# EAGLE design BATT_CONNECTOR (EAGLE 9.6.2)
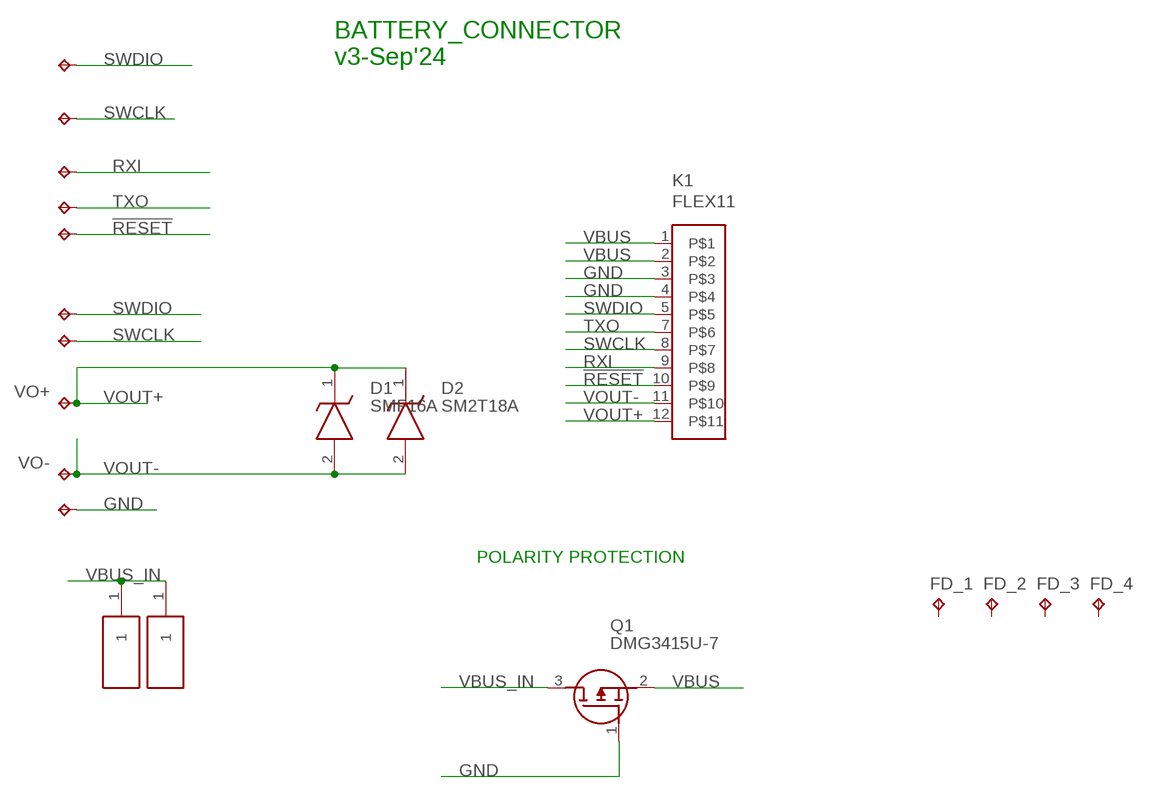
[diagram p0: schematic, sheet 1]

## Parts
!RESET  TPB2,54  [B2,54]
D1  SMF16A  [SODFL3618X110N]
D2  SM2T18A  [SM2T18A]
DAT  TPB2,54  [B2,54]
FD_1  FD_1  TPTP06SQ  [TP06SQ]
FD_2  FD_1  TPTP06SQ  [TP06SQ]
FD_3  FD_1  TPTP06SQ  [TP06SQ]
FD_4  FD_1  TPTP06SQ  [TP06SQ]
GND  TPB2,54  [B2,54]
H1  S1761-42R  [S176142R]
H2  S1761-42R  [S176142R]
ID  TPB2,54  [B2,54]
K1  FLEX11  [FLEX11]
Q1  DMG3415U-7  SSM3J338R,LF  [SSM3J332RLFT]
RXI  TPB2,54  [B2,54]
SWCLK  TPB2,54  [B2,54]
SWDIO  TPB2,54  [B2,54]
TXO  TPB2,54  [B2,54]
VO+  TPB2,54  [B2,54]
VO-  TPB2,54  [B2,54]

## Nets
!RESET: !RESET.TP K1.10
GND: GND.TP K1.3 K1.4 Q1.1(G)
RXI: K1.9 RXI.TP
SWCLK: ID.TP K1.8 SWCLK.TP
SWDIO: DAT.TP K1.5 SWDIO.TP
TXO: K1.7 TXO.TP
VBUS: K1.1 K1.2 Q1.2(S)
VBUS_IN: H1.1 H2.1 Q1.3(D)
VOUT+: D1.1(K) D2.1(K) K1.12 VO+.TP
VOUT-: D1.2(A) D2.2(A) K1.11 VO-.TP
Unconnected: FD_1.TP FD_2.TP FD_3.TP FD_4.TP

## Notes on the sheet
- BATTERY_CONNECTOR
  v3-Sep'24
- POLARITY PROTECTION

## Library data of the parts
!RESET DAT FD_1-FD_4 GND ID RXI SWCLK SWDIO TXO VO+ VO- = testpad:TP: Test pad
D1 = SMF16A:SMF16A: ESD Suppressors / TVS Diodes 200W 16V 5% Uni-directional Source: Datasheet <https://www.littelfuse.com/~/media/electronics/datasheets/tvs_diodes/littelfuse_tvs_diode_smf_datasheet.pdf.pdf>; ARROW_PART_NUMBER: SMF16A; ARROW_PRICE-STOCK: https://www.arrow.com/en/products/smf16a/littelfuse; DESCRIPTION: ESD Suppressors / TVS Diodes 200W 16V 5% Uni-directional; HEIGHT: 1.1mm; MANUFACTURER_NAME: LITTELFUSE; MANUFACTURER_PART_NUMBER: SMF16A; MOUSER_PART_NUMBER: 576-SMF16A; MOUSER_PRICE-STOCK: https://www.mouser.co.uk/ProductDetail/Littelfuse/SMF16A?qs=IP%252BaFeBnnar8T%2Ffm%252BJ%2Flrw%3D%3D
D2 = SM2T18A:SM2T18A: 200 W TVS in STmite Source: Datasheet <https://www.st.com/resource/en/datasheet/sm2t.pdf>; DESCRIPTION: 200 W TVS in STmite; HEIGHT: 1.15mm; MANUFACTURER_NAME: STMicroelectronics; MANUFACTURER_PART_NUMBER: SM2T18A; MOUSER_PART_NUMBER: 511-SM2T18A; MOUSER_PRICE-STOCK: https://www.mouser.co.uk/ProductDetail/STMicroelectronics/SM2T18A?qs=9NrABl3fj%2FoQ9e7jVf8sKA%3D%3D
H1 H2 = S1761-42R:S1761-42R: EZ_Boardware SMT Spring Contact 3.5mm Source: Datasheet <https://cdn.harwin.com/pdfs/S1761-XXR.pdf>; DESCRIPTION: EZ_Boardware SMT Spring Contact 3.5mm; HEIGHT: 3.8mm; MANUFACTURER_NAME: Harwin; MANUFACTURER_PART_NUMBER: S1761-42R; MOUSER_PART_NUMBER: 855-S1761-42R; MOUSER_PRICE-STOCK: https://www.mouser.co.uk/ProductDetail/Harwin/S1761-42R?qs=ulE8k0yEMYZkmoaxRCFkSQ%3D%3D
K1 = Flex_3mm:FLEX11
Q1 = SSM3J338R_LF:SSM3J338R,LF: MOSFET Small-signal MOSFET Vdss= -12V, ID= -6A Source: Datasheet <http://toshiba.semicon-storage.com/info/docget.jsp?did=30384&prodName=SSM3J338R>; ARROW_PART_NUMBER: SSM3J338R,LF; ARROW_PRICE-STOCK: https://www.arrow.com/en/products/ssm3j338rlf/toshiba?region=nac; DESCRIPTION: MOSFET Small-signal MOSFET Vdss= -12V, ID= -6A; HEIGHT: mm; MANUFACTURER_NAME: Toshiba; MANUFACTURER_PART_NUMBER: SSM3J338R,LF; MOUSER_PART_NUMBER: 757-SSM3J338RLF; MOUSER_PRICE-STOCK: https://www.mouser.co.uk/ProductDetail/Toshiba/SSM3J338RLF?qs=lhkzy8lC%252BSvURFM9ZjmJSw%3D%3D

## Board
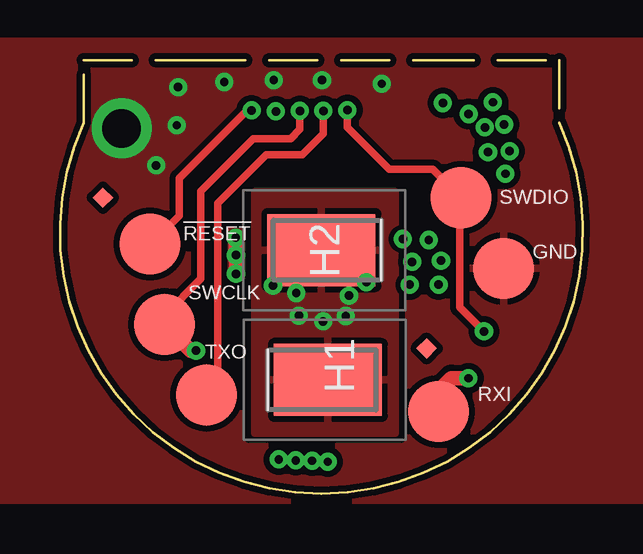
[diagram p1: board, top side]
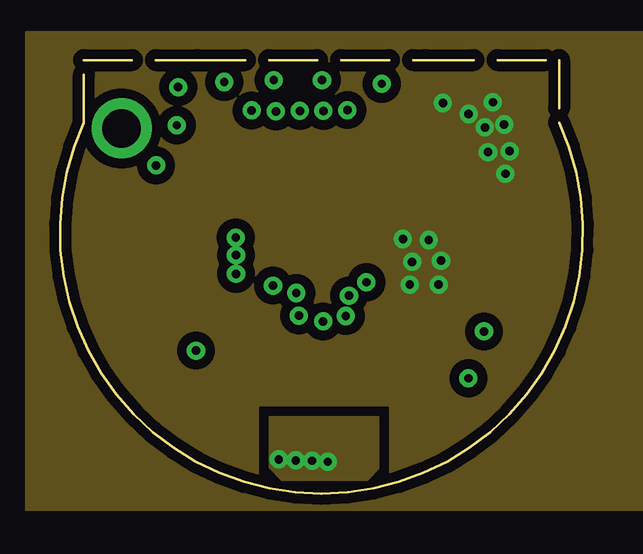
[diagram p2: board, inner layer Route2]
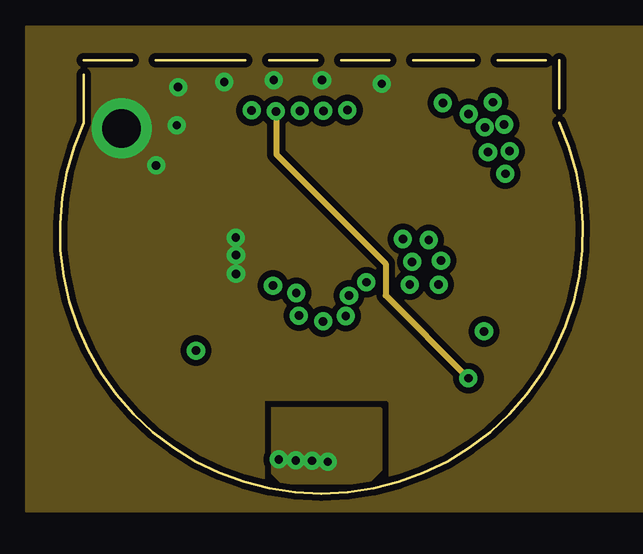
[diagram p3: board, inner layer Route15]
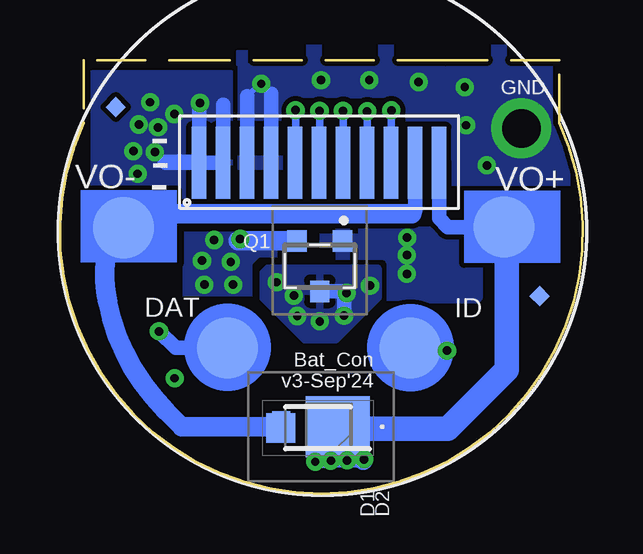
[diagram p4: board, bottom side, seen from below]

Size 21.79 x 18.07 mm. Coordinates in mm from the lower left corner, seen from the top.
Outline: 20.79,18.07 20.79,15.46 arc-229 0.99,15.46 0.99,18.07 5.73,18.07 5.71,18.06 15.21,18.06 15.23,18.07 20.79,18.07
Copper layers (1+2*15+16): Top 0.035mm / dielectric 1.5mm / Route2 0.035mm / dielectric 0.15mm / Route15 0.035mm / dielectric 0.2mm / Bottom 0.035mm
Design rules "default *": minimum track width 0.00038125mm, minimum drill 0.35mm, track to track 8mil, track to pad 8mil, pad to pad 8mil, via to via 8mil, smd to smd 5mil, copper to edge 8mil, drill to drill 8mil, minimum pad ring 10mil, minimum via ring 8mil, stop-mask expansion 2mil, vias tented up to drill 50mil, thermal gap 10mil
tRestrict: area 7.3,11.4 to 7.7,12.5; area 7.1,5.2 to 7.8,8.6
bRestrict: area 21,9.5 to 21.7,12.6; area 0.2,9.5 to 0.9,12.6

### Footprints (pad centres in the part's own frame; a part is rotated, then mirrored left to right if it is on the bottom)
B2,54 = smd 2.54 x 2.54: TP 0,0
SODFL3618X110N = smd 1.2 x 1.22: 1 -1.55,0; 2 1.55,0
SM2T18A = smd 2.67 x 2.54: 1 -0.698,0 | smd 0.762 x 1.27: 2 1.653,0
TP06SQ = smd 0.6 x 0.6: TP 0,0
S176142R = smd 3 x 4.5: 1 0,-2
FLEX11 = smd 0.6 x 3: 1 0.8,2.05; 2 1.8,2.05; 3 2.8,2.05; 4 3.8,2.05; 5 4.8,2.05; 7 5.8,2.05; 8 6.8,2.05; 9 7.8,2.05; 10 8.8,2.05; 11 9.8,2.05; 12 10.8,2.05
SSM3J332RLFT = smd 0.8 x 0.9: 1 -0.95,-1.05; 2 0.95,-1.05; 3 0,1.05

### Placement (x,y rotation side)
!RESET  3.74,10.41 0 top
D1  11.04,2.74 180 bottom
D2  10.91,2.79 180 bottom
DAT  14.81,6.07 0 bottom
FD_1  1.8,8.23 45 bottom
FD_2  19.46,16.11 45 bottom
FD_3  1.78,12.33 45 top
FD_4  15.27,6.05 45 top
GND  18.48,9.39 0 top
H1  13.16,4.74 270 top
H2  8.89,10.15 90 top
ID  7.19,6.07 0 bottom
K1  16.79,11.73 0 bottom
Q1  10.96,9.48 180 bottom
RXI  15.77,3.42 0 top
SWCLK  4.35,7.05 0 top
SWDIO  16.7,12.33 0 top
TXO  6.1,4.11 0 top
VO+  3.29,11.11 0 bottom
VO-  19.13,11.08 0 bottom

### Tracks (layer width: path | path; a pad name or v marks a point on that pad's centre or on a via)
!RESET  (via drill 0.35)
  Top 0.305: !RESET.TP 3.8,10.41 4.97,11.58 4.97,13.15 7.79,15.97 v7.98,15.97
  Bottom 0.203: K1.10
  Bottom 0.305: v7.98,15.97 K1.10
GND  (via drill 0.35, 1.6 pad 2.5)
  Top 0.61: v7.32,10.67 v7.32,9.95 v7.33,9.94 v7.33,9.16
  Bottom 0.203: 12.99,16.67 v13.4,17.08 13.47,17.08 13.99,16.56
  Bottom 0.61: 12.99,16.67 K1.4 | 13.99,16.56 K1.3
  other vias: 6.84,17.15 4,13.68 4.86,15.35 4.92,16.94 8.9,17.23 10.91,17.23 2.56,15.22
  pour Top (isolate 0.254, rank 2): -5.02,18.85 24.97,18.85 24.97,-0.28 -5.02,-0.28
  pour Route15 (isolate 0.254, rank 2): -1.42,19.46 -1.42,-0.74 25.06,-0.74 25.06,19.46
  pour Bottom (rank 2): 0.36,18.42 14.06,18.42 14.46,18.02 14.46,11.92 10.96,11.92 10.66,11.62 10.66,9.32 8.56,9.32 8.46,9.22 8.46,8.22 4.46,8.22 4.46,9.32 0.36,13.42
RXI  (via drill 0.35)
  Top 0.61: RXI.TP 15.77,4.28 16.3,4.81 v17.01,4.81
  Route15 0.203: v8.99,15.93 9.01,15.91
  Route15 0.254: v17.01,4.81 13.56,8.26 13.56,9.59 9.01,14.14 9.01,15.91
  Bottom 0.203: v8.99,15.93
  Bottom 0.305: K1.9 v8.99,15.93
SWCLK  (via drill 0.35)
  Top 0.254: SWCLK.TP 4.35,7.44
  Top 0.305: 4.35,7.44 5.86,8.95 5.86,12.6 8.05,14.79 9.6,14.79 9.99,15.18 v9.99,15.95 | 4.56,6.85 SWCLK.TP
  Top 0.61: v5.66,5.96 5.44,5.96 4.56,6.85
  Bottom 0.305: v9.99,15.95 K1.8
  Bottom 0.61: ID.TP 7.09,5.96 v5.66,5.96
SWDIO  (via drill 0.35)
  Top 0.305: v11.97,15.98 11.97,15.26 13.72,13.51 15.52,13.51 SWDIO.TP 16.66,12.29 16.66,7.76 v17.66,6.76
  Bottom 0.203: 11.97,13.8 K1.5
  Bottom 0.305: v11.97,15.98 11.97,13.8
  Bottom 0.61: DAT.TP 16.97,6.07 v17.66,6.76
TXO  (via drill 0.35)
  Top 0.305: TXO.TP 6.23,4.11 6.57,4.45 6.57,12.11 8.58,14.12 10.1,14.12 10.97,15 v10.97,15.95
  Bottom 0.203: 10.97,13.8 K1.7
  Bottom 0.305: v10.97,15.95 10.97,13.8
VBUS  (via drill 0.35)
  Bottom 0.61: v14.28,10.61 14.36,10.53 | 14.99,16.21 K1.2 17.38,13.78 17.42,13.82 16.03,13.82 K1.1 15.99,16.24 v15.95,16.28
  Bottom 0.813: Q1.2 14.36,10.53
  other vias: 18.03,16.31 17.02,15.82 17.83,14.23 18.73,14.27 18.5,15.38 14.67,9.66 15.36,10.57 15.87,9.71 18.55,13.33 17.7,15.26 15.77,8.71 14.57,8.71
  pour Route2 (isolate 0.406, rank 2): -1.44,19.22 -1.44,-0.68 25.07,-0.68 25.07,19.22
  pour Bottom: 14.63,17.62 14.63,12.13 20.46,12.13 20.46,17.62
  pour Bottom (isolate 0.305, rank 2): 12.77,8.24 16.63,8.24 16.63,11.22 12.77,11.22
VBUS_IN  (via drill 0.35)
  Bottom 0.61: Q1.3 10.06,8.43 9.95,8.32 v9.95,7.42
  other vias: 10.96,7.18 9.84,8.36 11.9,7.4 12.04,8.25 8.87,8.67 12.76,8.81
  pour Top: 8.1,12.59 13.96,12.59 13.96,2.51 8.1,2.51
  pour Bottom (isolate 0.254): 8.58,9.4 13.12,9.4 13.31,9.21 13.31,8.14 11.59,6.42 10.29,6.42 8.52,8.19 8.52,9.36 8.55,9.39
VOUT+  (via drill 0.35)
  Bottom 0.61: v9.11,1.43 9.15,1.39 v9.82,1.39 10.48,1.39 v10.5,1.37 11.11,1.37 v11.15,1.33 | K1.12 5.99,11.48 5.62,11.11 VO+.TP
  Bottom 0.813: D1.1 10.17,2.74 D2.1 10.22,2.45 9.15,1.39
  Bottom 1.016: VO+.TP 3.16,10.98 3.16,5.17 5.63,2.71 9.46,2.71 D1.1
  pour Route2 (isolate 0.254): 8.71,1.1 9.22,0.59 12.81,0.59 13.27,1.05 13.27,3.19 8.71,3.19
  pour Route15 (isolate 0.254): 8.82,3.58 8.82,0.85 9.21,0.46 9.24,0.43 12.57,0.43 12.83,0.43 13.4,1 13.4,3.52 13.37,3.55 8.85,3.55
VOUT-
  Bottom 0.152: VO-.TP 19.17,11.12 19.56,11.12
  Bottom 0.61: K1.11 6.99,11.79 7.12,11.66
  Bottom 0.813: VO-.TP 18.55,11.66 7.12,11.66 | 19.56,11.12 arc-32 19.81,7.98 arc-34 17.38,3.46 16.71,2.79 D2.2 | D2.2 12.59,2.76 | D1.2 12.57,2.77 D2.2
(copper drawn outside any net)
  shapes: Bottom area x2, Bottom circle x2

### Text on the board
bPlace: Bat_Con / v3-Sep'24
bNames: GND | - | - | -